# EAGLE design Adafruit HDC1008 (EAGLE 6.6.0)
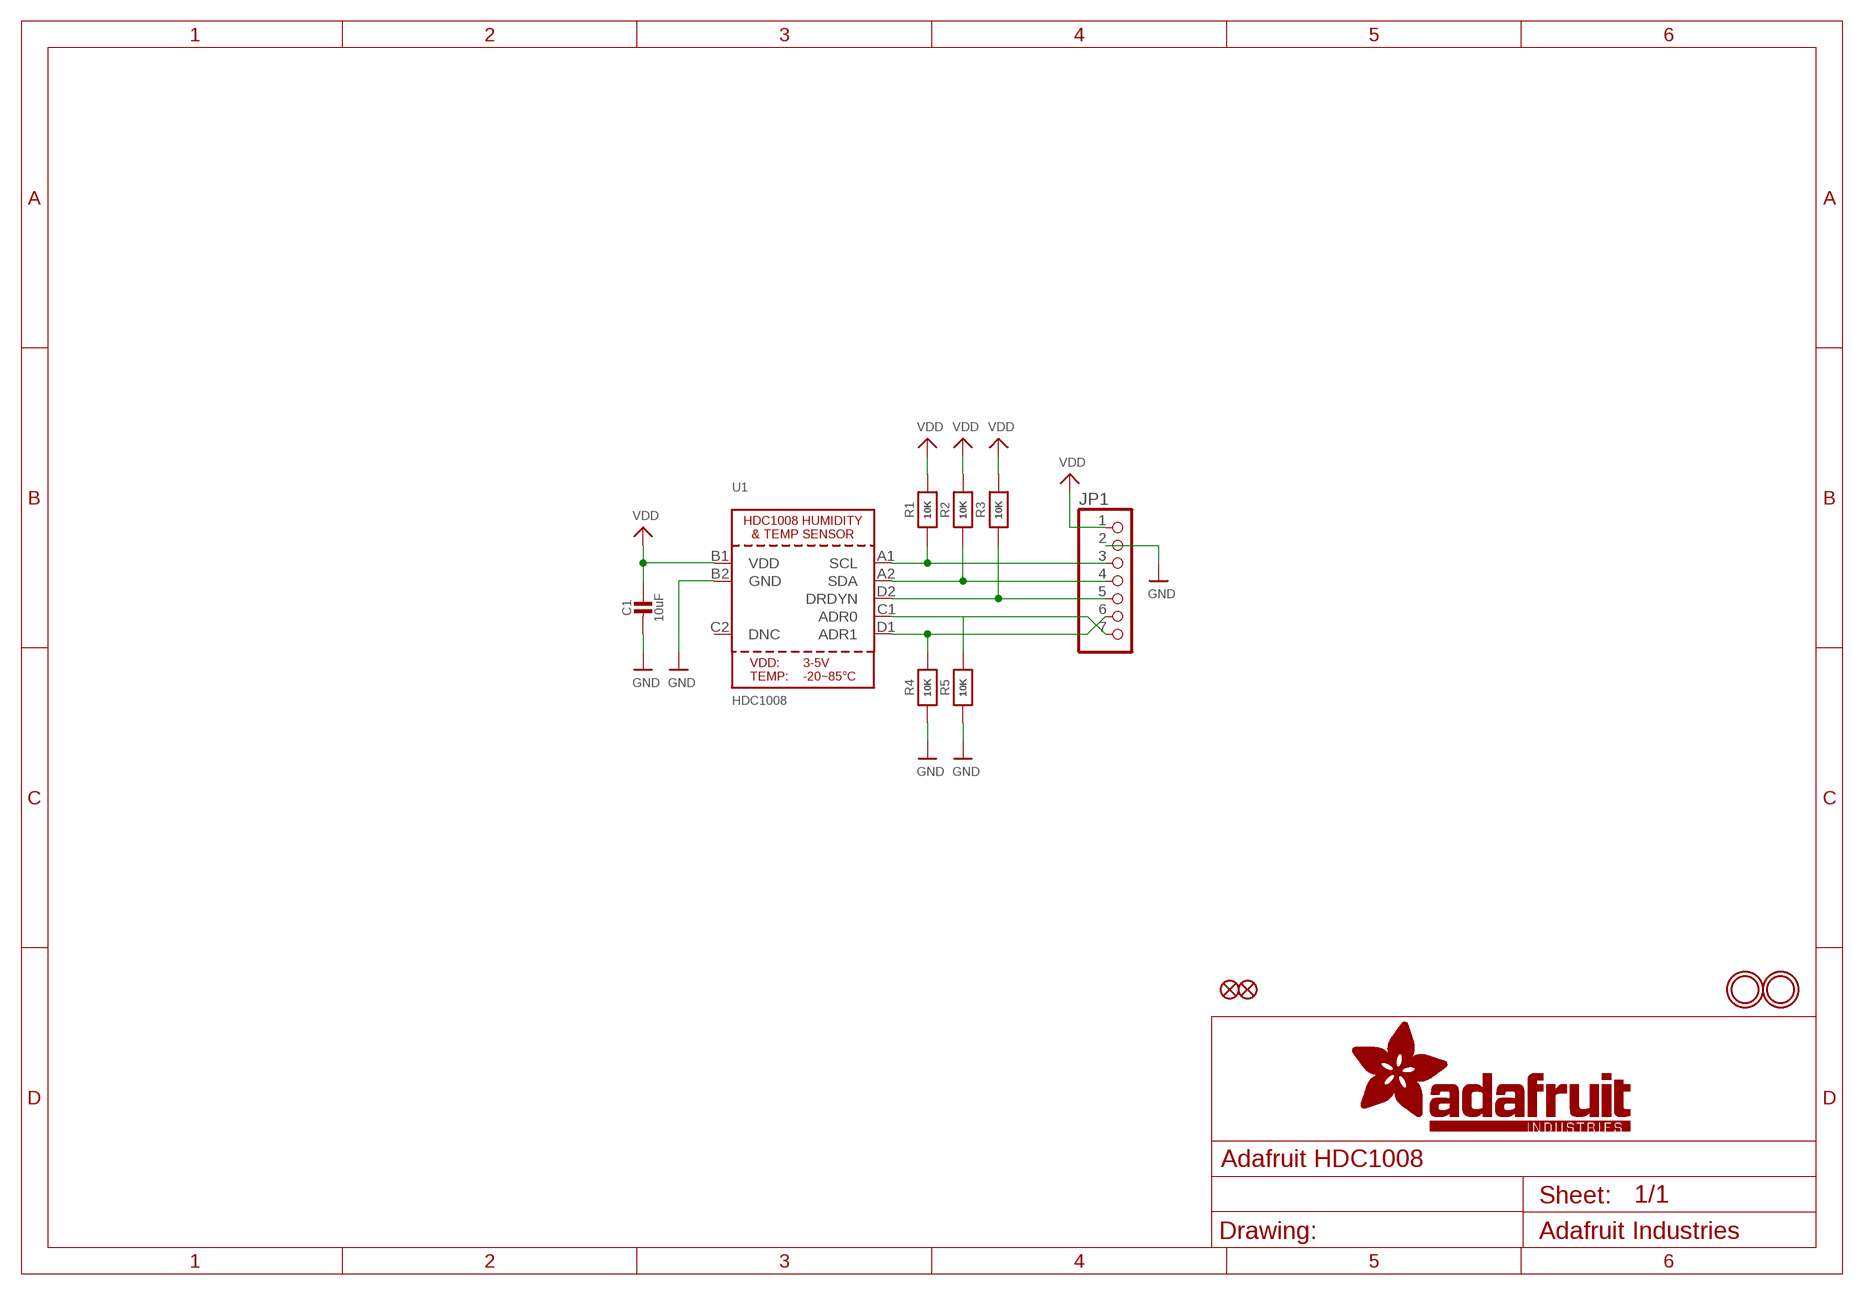
[diagram p0: schematic, sheet 1]

## Parts
C1  10uF  CAP_CERAMIC0805-NOOUTLINE  [0805-NO]
FID1  FIDUCIAL""  [FIDUCIAL_1MM]
FID2  FIDUCIAL""  [FIDUCIAL_1MM]
JP1  HEADER-1X770MIL  [1X07_ROUND_70]
R1  10K  RESISTOR0805_NOOUTLINE  [0805-NO]
R2  10K  RESISTOR_0805MP  [_0805MP]
R3  10K  RESISTOR0805_NOOUTLINE  [0805-NO]
R4  10K  RESISTOR0805_NOOUTLINE  [0805-NO]
R5  10K  RESISTOR0805_NOOUTLINE  [0805-NO]
U1  HDC1008  [DSBGA8_HDC1008]
U$2  MOUNTINGHOLE2.5  [MOUNTINGHOLE_2.5_PLATED]
U$3  MOUNTINGHOLE2.5  [MOUNTINGHOLE_2.5_PLATED]

## Nets
A0: JP1.7 R5.2 U1.C1(ADR0)
A1: JP1.6 R4.2 U1.D1(ADR1)
GND: C1.2 JP1.2 R4.1 R5.1 U1.B2(GND)
RDY: JP1.5 R3.1 U1.D2(DRDYN)
SCL: JP1.3 R1.1 U1.A1(SCL)
SDY: JP1.4 R2.1 U1.A2(SDA)
VDD: C1.1 JP1.1 R1.2 R2.2 R3.2 U1.B1(VDD)
Unconnected: U1.C2(DNC)

## Library data of the parts
C1 = microbuilder:CAP_CERAMIC: Ceramic Capacitors For new designs, use the packages preceded by an '_' character since they are more reliable: The following footprints should be used on most boards: _0402 - Standard footprint for regular board layouts _0603 - Standard footprint for regular board layouts _0805 - Standard footprint for regular board layouts _1206 - Standard footprint for regular board layouts For extremely tight-pitch boards where space is at a premium, the following 'micro-pitch' footprints can be used (smaller pads, no silkscreen outline, etc.): _0402MP - Micro-pitch footprint for very dense/compact boards _0603MP - Micro-pitch footprint for very dense/compact boards _0805MP - Micro-pitch footprint for very dense/compact boards _1206MP - Micro-pitch footprint for very dense/compact boards
FID1 FID2 = microbuilder:FIDUCIAL: Fiducial Alignment Points Various fiducial points for machine vision alignment.; BOM: EXCLUDE
JP1 = microbuilder:HEADER-1X7: PIN HEADER
R1-R5 = microbuilder:RESISTOR: Resistors For new designs, use the packages preceded by an '_' character since they are more reliable: The following footprints should be used on most boards: _0402 - Standard footprint for regular board layouts _0603 - Standard footprint for regular board layouts _0805 - Standard footprint for regular board layouts _1206 - Standard footprint for regular board layouts For extremely tight-pitch boards where space is at a premium, the following 'micro-pitch' footprints can be used (smaller pads, no silkscreen outline, etc.): _0402MP - Micro-pitch footprint for very dense/compact boards _0603MP - Micro-pitch footprint for very dense/compact boards _0805MP - Micro-pitch footprint for very dense/compact boards _1206MP - Micro-pitch footprint for very dense/compact boards
U1 = microbuilder:HDC1008: HDC1008 - Humidity and Temperature Sensor
U$2 U$3 = microbuilder:MOUNTINGHOLE: Mounting Hole For #2 screws (0.086"/2.18mm width, 0.094"/2.4mm hole) use 2.5mm; BOM: EXCLUDE

## Board
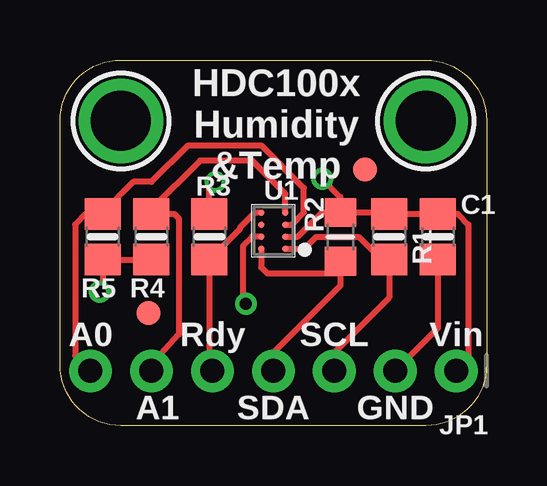
[diagram p1: board, top side]
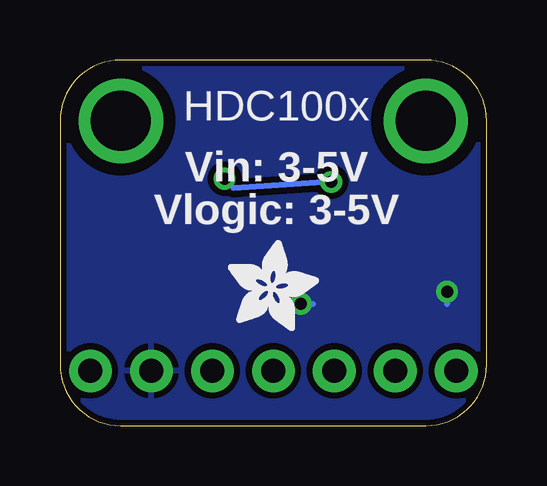
[diagram p2: board, bottom side, seen from below]

Size 17.78 x 15.24 mm. Coordinates in mm from the lower left corner, seen from the top.
Outline: 17.78,12.7 17.78,2.54 arc-90 15.24,0 2.54,0 arc-90 0,2.54 0,12.7 arc-90 2.54,15.24 15.24,15.24 arc-90 17.78,12.7
Copper layers (1*16): Top 0.035mm / dielectric 1.5mm / Bottom 0.035mm
Design rules "adafruit": minimum track width 8mil, minimum drill 15.5mil, track to track 8mil, track to pad 8mil, pad to pad 8mil, via to via 8mil, smd to smd 8mil, copper to edge 10mil, drill to drill 8mil, minimum pad ring 10mil, minimum via ring 8mil, stop-mask expansion 2mil, vias tented up to drill 20mil, thermal gap 10mil

### Footprints (pad centres in the part's own frame; a part is rotated, then mirrored left to right if it is on the bottom)
0805-NO = smd 1.3 x 1.5: 1 -0.95,0; 2 0.95,0
FIDUCIAL_1MM = smd 1 x 1: 1 0,0
1X07_ROUND_70 = drill 1 pad 1.778: 1 -7.62,0; 2 -5.08,0; 3 -2.54,0; 4 0,0; 5 2.54,0; 6 5.08,0; 7 7.62,0
_0805MP = smd 1.2 x 1.3: 1 -1.016,0; 2 1.016,0
DSBGA8_HDC1008 = smd 0.263 x 0.263: A1 -0.5,0.75; A2 0.5,0.75; B1 -0.5,0.25; B2 0.5,0.25; C1 -0.5,-0.25; C2 0.5,-0.25; D1 -0.5,-0.75; D2 0.5,-0.75
MOUNTINGHOLE_2.5_PLATED = drill 2.5 pad 3.2: P$1 0,0

### Placement (x,y rotation side)
C1  15.75,7.87 270 top
FID1  3.68,4.7 0 top
FID2  12.7,10.67 0 top
JP1  8.89,2.29 180 top
R1  13.72,7.87 90 top
R2  11.68,7.87 90 top
R3  6.22,7.87 90 top
R4  3.81,7.87 90 top
R5  1.78,7.87 90 top
U1  8.89,8.13 180 top
U$2  2.54,12.7 0 top
U$3  15.24,12.7 0 top
U$14  [ADAFRUIT_3.5MM]  10.79,3.94 0 bottom

### Tracks (layer width: path | path; a pad name or v marks a point on that pad's centre or on a via)
A0
  Top 0.254: U1.C1 9.65,8.38 10.16,8.89 10.16,9.91 8.38,11.68 5.33,11.68 3.81,10.16 3.05,10.16 2.54,9.65 R5.2 1.08,8.82 0.64,8.38 0.64,2.92 JP1.7
A1
  Top 0.254: U1.D1 9.39,9.66 8,11.05 5.84,11.05 3.81,9.02 R4.2 4.76,8.82 4.95,8.64 4.95,3.81 3.81,2.54 JP1.6
GND  (via drill 0.5)
  Top 0.254: C1.2 15.75,4.06 JP1.2 | R4.1 R5.1 1.78,5.71 v1.65,5.59 | U1.B2 8.01,7.88 7.62,7.49 7.62,5.21 v7.75,5.08
  Bottom 0.254: v1.65,5.59 1.65,5.08 | v7.75,5.08 7.24,5.08
  pour Bottom (isolate 0.254): 0,0 0,12.7 arc-90 2.54,15.24 15.24,15.24 arc-90 17.78,12.7 17.78,0
RDY
  Top 0.254: JP1.5 6.22,2.54 R3.1 7.49,8.19 7.49,8.26 8.12,8.88 U1.D2
SCL
  Top 0.254: JP1.3 11.43,3.05 13.72,5.33 R1.1 13.4,6.92 12.45,7.87 10.67,7.87 10.17,7.38 U1.A1
SDY
  Top 0.254: R2.1 11.68,6.35 | 11.68,6.35 11.68,5.84 8.89,3.05 JP1.4 | U1.A2 8.38,6.6 8.64,6.35 11.68,6.35
VDD  (via drill 0.5)
  Top 0.254: U1.B1 9.91,7.88 10.92,8.89 R2.2 | R2.2 13.65,8.89 R1.2 C1.1 16.58,8.82 17.02,8.38 17.02,2.79 JP1.1 | R3.2 6.22,9.91 v6.48,10.16 | v10.92,10.29 11.68,9.53 R2.2
  Bottom 0.254: v6.48,10.16 10.54,9.91 v10.92,10.29

### Text on the board
tPlace: HDC100x / Humidity / &Temp | A0 | Rdy | SCL | Vin | A1 | SDA | GND
bPlace: HDC100x | Vin: 3-5V | Vlogic: 3-5V